# EAGLE design Tracksoar v1.2 (EAGLE 7.3.0)
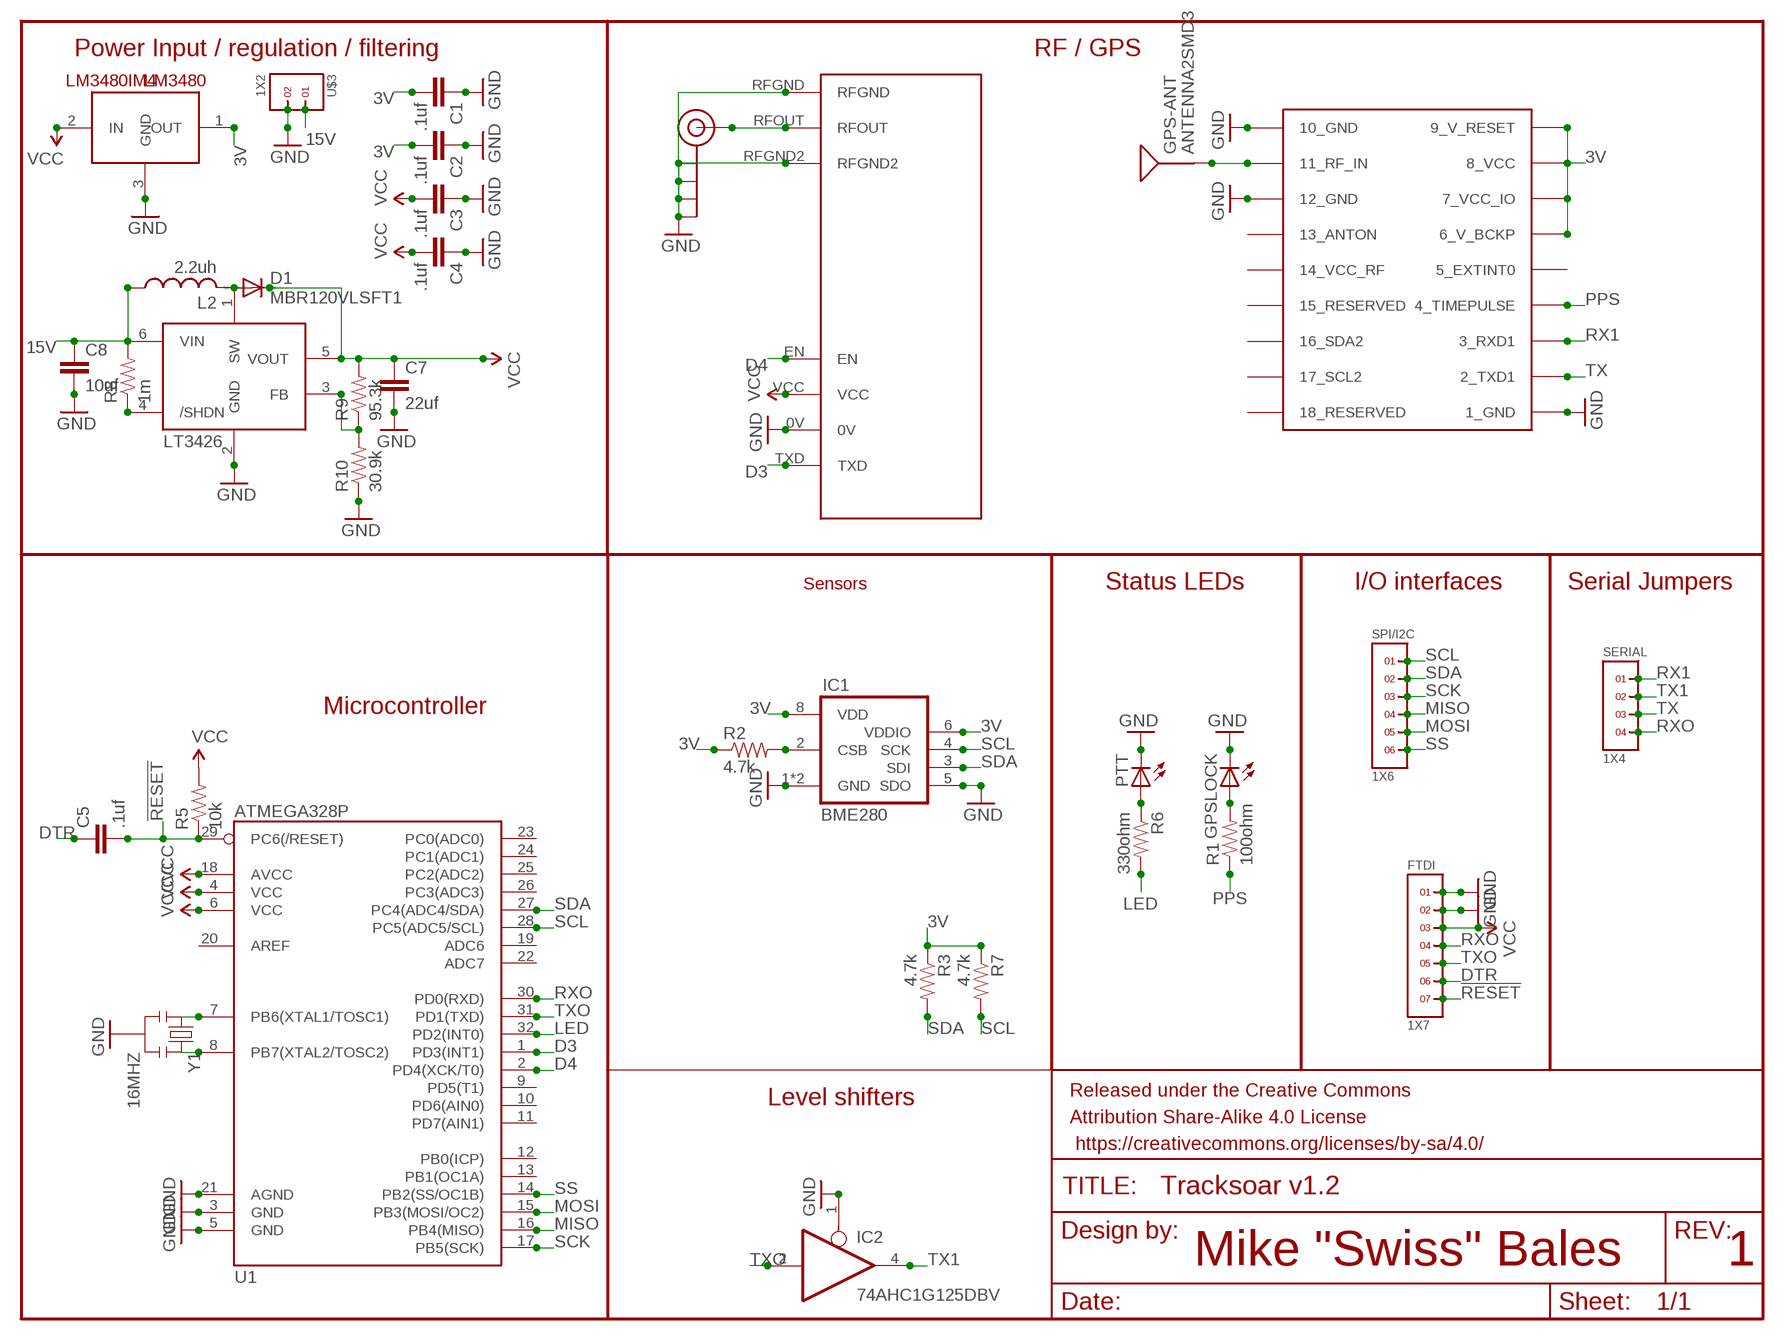
[diagram p0: schematic, sheet 1]

## Parts
C1  .1uf  CAP0805  [0805]
C2  .1uf  CAP0805  [0805]
C3  .1uf  CAP0805  [0805]
C4  .1uf  CAP0805  [0805]
C5  .1uf  CAP0805  [0805]
C7  22uf  CAP0805  [0805]
C8  10uf  CAP0805  [0805]
D1  MBR120VLSFT1  DIODE-SOD123  [SOD123]
FRAME1  FRAME-LETTER  [CREATIVE_COMMONS]
FTDI  1X7  [1X7]
GPS-ANT  ANTENNA2SMD3  [ANTENNA-CHIP4]
GPSLOCK  LEDCHIP-LED0805  [CHIP-LED0805]
IC1  BME280  [BME280]
IC2  74AHC1G125DBV  [SOT23-5]
J$1  SMA_EDGE  [SMA-EDGE]
L2  2.2uh  L-USL1812  [L1812]
LM3480  LM3480IM4  [SOT23-3]
LT3426  LT3426  [SOT23-6]
PTT  LEDCHIP-LED0805  [CHIP-LED0805]
R1  100ohm  RESISTOR0805-RES  [0805]
R2  4.7k  RESISTOR0805-RES  [0805]
R3  4.7k  RESISTOR0805-RES  [0805]
R5  10k  RESISTOR0805-RES  [0805]
R6  330ohm  RESISTOR0805-RES  [0805]
R7  4.7k  RESISTOR0805-RES  [0805]
R8  1m  RESISTOR0805-RES  [0805]
R9  95.3k  RESISTOR0805-RES  [0805]
R10  30.9k  RESISTOR0805-RES  [0805]
SERIAL  1X4  [1X4]
SPI/I2C  1X6  [1X6]
U1  ATMEGA328P  ATMEGA168MLF  [MLF32]
U$1  UBLOX_MAX  [UBLOX_MAX]
U$2  RADIOMETRIX-HX1  [RADIOMETRIX-HX1]
U$3  1X2  [1X2]
Y1  16MHZ  RESONATOR16MHZ  [RESONATOR-SMD]

## Nets
3V: C1.2 C2.2 IC1.6(VDDIO) IC1.8(VDD) LM3480.1(OUT) R2.1 R3.1 R7.1 U$1.6_V_BCKP U$1.7_VCC_IO U$1.8_VCC U$1.9_V_RESET
15V: C8.1 L2.1 LT3426.6(VIN) R8.2 U$3.1
!RESET: C5.2 FTDI.7 R5.1 U1.29(PC6(/RESET))
D3: U1.1(PD3(INT1)) U$2.TXD
D4: U1.2(PD4(XCK/T0)) U$2.EN
DTR: C5.1 FTDI.6
GND: C1.1 C2.1 C3.1 C4.1 C7.2 C8.2 FTDI.1 FTDI.2 GPSLOCK.C IC1.1(GND) IC1.5(SDO) IC1.7(GND) IC2.1(OE) J$1.GND@0(GND) J$1.GND@1(GND) J$1.GND@2(GND) J$1.GND@3(GND) LM3480.3(GND) LT3426.2(GND) PTT.C R10.1 U1.3(GND) U1.5(GND) U1.21(AGND) U$1.1_GND U$1.10_GND U$1.12_GND U$2.0V U$2.RFGND U$2.RFGND2 U$3.2 Y1.2
LED: R6.2 U1.32(PD2(INT0))
MISO: SPI/I2C.4 U1.16(PB4(MISO))
MOSI: SPI/I2C.5 U1.15(PB3(MOSI/OC2))
N$1: J$1.SIG(SIGNAL) U$2.RFOUT
N$2: IC1.2(CSB) R2.2
N$3: GPSLOCK.A R1.2
N$6: GPS-ANT.SIG(SIGNAL) U$1.11_RF_IN
N$9: D1.A L2.2 LT3426.1(SW)
N$12: LT3426.4(/SHDN) R8.1
N$13: LT3426.3(FB) R9.1 R10.2
N$14: U1.8(PB7(XTAL2/TOSC2)) Y1.3
N$26: U1.7(PB6(XTAL1/TOSC1)) Y1.1
N$27: PTT.A R6.1
PPS: R1.1 U$1.4_TIMEPULSE
RX1: SERIAL.1 U$1.3_RXD1
RXO: FTDI.4 SERIAL.4 U1.30(PD0(RXD))
SCK: SPI/I2C.3 U1.17(PB5(SCK))
SCL: IC1.4(SCK) R7.2 SPI/I2C.1 U1.28(PC5(ADC5/SCL))
SDA: IC1.3(SDI) R3.2 SPI/I2C.2 U1.27(PC4(ADC4/SDA))
SS: SPI/I2C.6 U1.14(PB2(SS/OC1B))
TX: SERIAL.3 U$1.2_TXD1
TX1: IC2.4(O) SERIAL.2
TXO: FTDI.5 IC2.2(I) U1.31(PD1(TXD))
VCC: C3.2 C4.2 C7.1 D1.C FTDI.3 LM3480.2(IN) LT3426.5(VOUT) R5.2 R9.2 U1.4(VCC) U1.6(VCC) U1.18(AVCC) U$2.VCC
Unconnected: U1.9(PD5(T1)) U1.10(PD6(AIN0)) U1.11(PD7(AIN1)) U1.12(PB0(ICP)) U1.13(PB1(OC1A)) U1.19(ADC6) U1.20(AREF) U1.22(ADC7) U1.23(PC0(ADC0)) U1.24(PC1(ADC1)) U1.25(PC2(ADC2)) U1.26(PC3(ADC3)) U$1.5_EXTINT0 U$1.13_ANTON U$1.14_VCC_RF U$1.15_RESERVED U$1.16_SDA2 U$1.17_SCL2 U$1.18_RESERVED

## Notes on the sheet
- Power Input / regulation / filtering | RF / GPS
- Sensors | Status LEDs | I/O interfaces | Serial Jumpers
- Microcontroller
- Level shifters
- Mike "Swiss" Bales | 1

## Power pins joined to a net without a drawn wire
GND: IC2.3(GND)
VCC: IC2.5(VCC)

## Library data of the parts
C1-C5 C7 C8 = SparkFun-Capacitors:CAP: Capacitor Standard 0603 ceramic capacitor, and 0.1" leaded capacitor.
D1 = diode:DIODE-: DIODE
FRAME1 = SparkFun-Aesthetics:FRAME-LETTER: Schematic Frame Standard 8.5x11 US Letter frame
FTDI = headers(2mm):1X7
GPS-ANT = SparkFun-RF:ANTENNA2: Chip antenna Single endded antenna. Common with smaller chip antennas. CHIP4 package is the GPS Chip Antenna SKU: GPS-08418. CHIP5 package is 2.4GHz chip antenna SKU: WRL-00144.
GPSLOCK PTT = adafruit:LED: LED OSRAM: - CHIPLED LG R971, LG N971, LY N971, LG Q971, LY Q971, LO R971, LY R971 LH N974, LH R974 LS Q976, LO Q976, LY Q976 LO Q996 - Hyper CHIPLED LW Q18S LB Q993, LB Q99A, LB R99A - SideLED LS A670, LO A670, LY A670, LG A670, LP A670 LB A673, LV A673, LT A673, LW A673 LH A674 LY A675 LS A676, LA A676, LO A676, LY A676, LW A676 LS A679, LY A679, LG A679 - Hyper Micro SIDELED® LS Y876, LA Y876, LO Y876, LY Y876 LT Y87S - SmartLED LW L88C, LW L88S LB L89C, LB L89S, LG L890 LS L89K, LO L89K, LY L89K LS L896, LA L896, LO L896, LY L896 - TOPLED LS T670, LO T670, LY T670, LG T670, LP T670 LSG T670, LSP T670, LSY T670, LOP T670, LYG T670 LG T671, LOG T671, LSG T671 LB T673, LV T673, LT T673, LW T673 LH T674 LS T676, LA T676, LO T676, LY T676, LB T676, LH T676, LSB T676, LW T676 LB T67C, LV T67C, LT T67C, LS T67K, LO T67K, LY T67K, LW E67C LS E67B, LA E67B, LO E67B, LY E67B, LB E67C, LV E67C, LT E67C LW T67C LS T679, LY T679, LG T679 LS T770, LO T770, LY T770, LG T770, LP T770 LB T773, LV T773, LT T773, LW T773 LH T774 LS E675, LA E675, LY E675, LS T675 LS T776, LA T776, LO T776, LY T776, LB T776 LHGB T686 LT T68C, LB T68C - Hyper Mini TOPLED® LB M676 - Mini TOPLED Santana® LG M470 LS M47K, LO M47K, LY M47K Source: http://www.osram.convergy.de/
IC1 = bosch-bme280:BME280: DIGITAL HUMIDITY, PRESSURE AND TEMPERATURE SENSOR * Digital interface I²C (up to 3.4 MHz) and SPI (3 and 4 wire, up to 10 MHz)* Supply voltage VDD main supply voltage range: 1.71 V to 3.6 V*VDDIO interface voltage range: 1.2 V to 3.6 V Operating range -40…+85 °C, 0…100 % rel. humidity, 300…1100 hPa The library has been designed by Richard Magdycz <https://www.facebook.com/groups/eaglecadsoftUK>
IC2 = 74xx-little-us:74*1G125: Single Bus Buffer Gate with 3-State Output
J$1 = SparkFun-Connectors:SMA_EDGE: SMA Antenna Connector End launch SMA connector. The paste layer has been removed so that the connector can be hand soldered onto the board after reflow.
L2 = resistor:L-US: INDUCTOR, American symbol
LM3480 = SparkFun-PowerIC:LM3480IM4: Small package linear regulator
LT3426 = adafruit:LT3426: LT3426 1.2MHz, 2A boost converter in SOT-23 http://www.linear.com/pc/productDetail.jsp?navId=H0,C1,C1003,C1042,C1031,C1061,P8430 (Linear website)
R1-R3 R5-R10 = SparkFun-Resistors:RESISTOR: Resistor Basic schematic elements and footprints for 0603, 1206, and PTH resistors.
SERIAL = headers(2mm):1X4
SPI/I2C = headers(2mm):1X6
U1 = SparkFun-DigitalIC:ATMEGA168: Atmel 32-pin 8-bit micro, 16k flash.
U$1 = Ava:UBLOX_MAX: UBLOX MAX
U$2 = Ava:RADIOMETRIX-HX1
U$3 = headers(2mm):1X2
Y1 = SparkFun-FreqCtrl:RESONATOR: Resonator Small SMD resonator. Used, eg, on the Arduino Pro/ Pro Mini boards. 8MHz- XTAL-08895 16MHz- XTAL-08900; PROD_ID: XTAL-08900

## Board
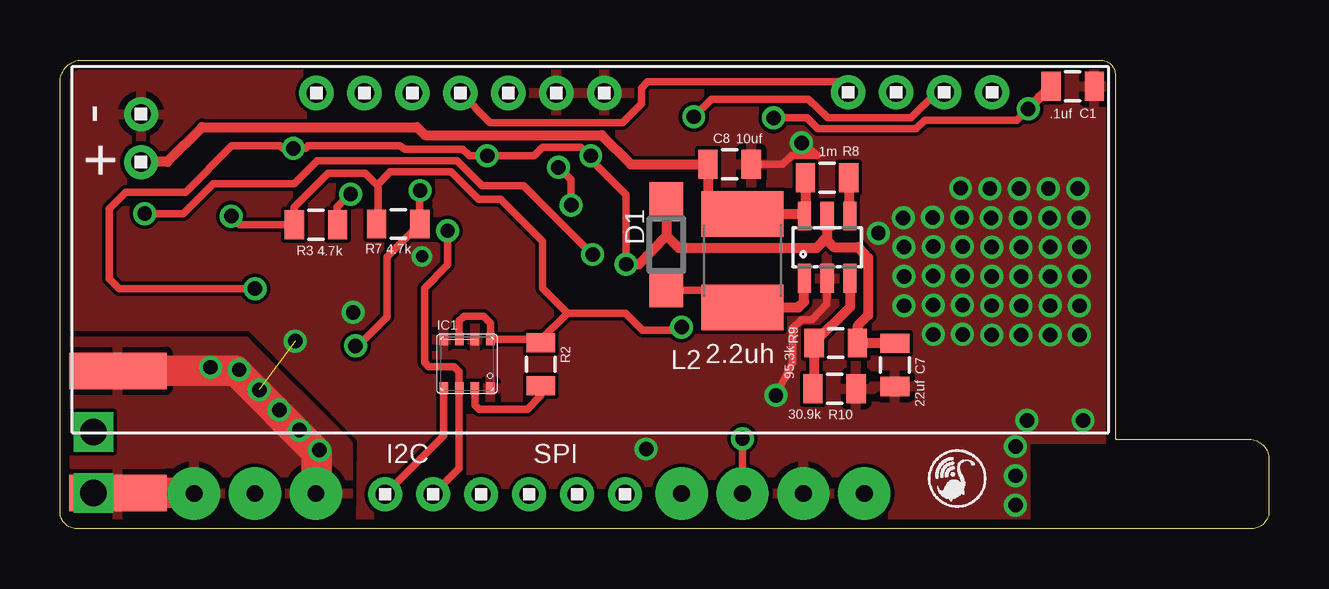
[diagram p1: board, top side]
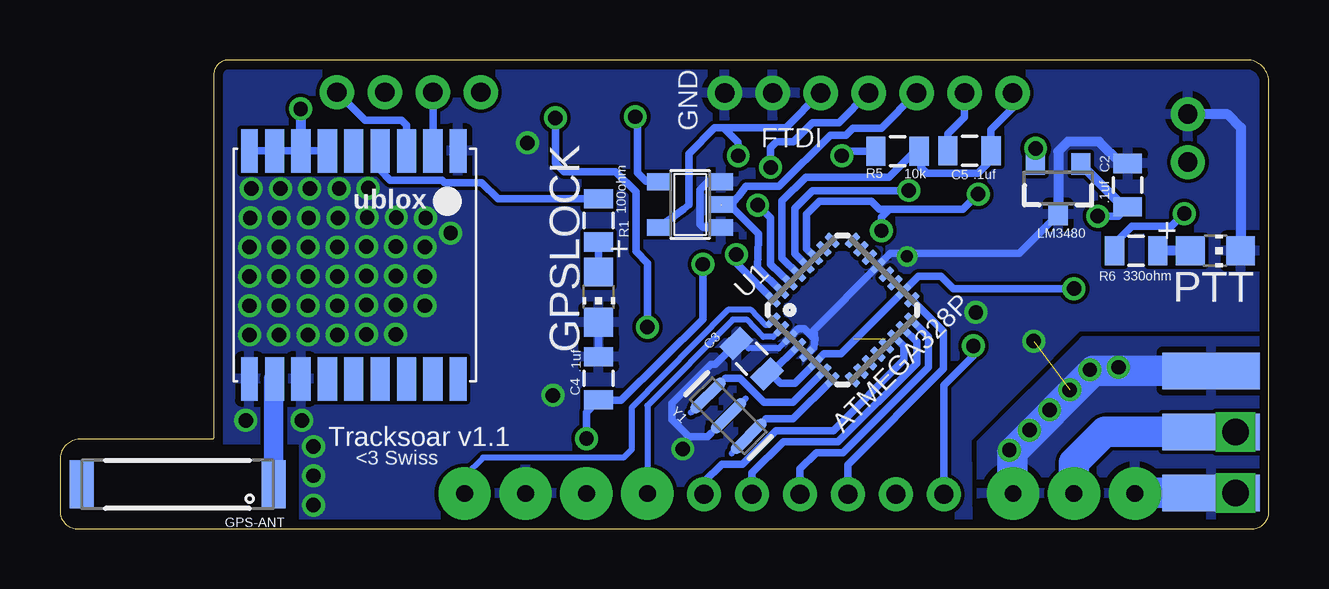
[diagram p2: board, bottom side, seen from below]

Size 50.39 x 19.53 mm. Coordinates in mm from the lower left corner, seen from the top.
Outline: 0.69,0 arc-90 0,0.76 0,18.67 arc-90 0.99,19.53 43.38,19.53 arc-90 43.99,18.87 43.99,3.78 arc90 44.04,3.73 49.58,3.73 arc-90 50.39,2.87 50.39,0.79 arc-90 49.68,0 0.69,0
Copper layers (1*16): Top 0.0356mm / dielectric 1.5011mm / Bottom 0.0356mm
Design rules "oshpark-2layer": minimum track width 6mil, minimum drill 13mil, track to track 6mil, track to pad 6mil, pad to pad 6mil, via to via 6mil, smd to smd 6mil, copper to edge 15mil, drill to drill 6mil, minimum pad ring 7mil, minimum via ring 7mil, stop-mask expansion 4mil, vias tented up to drill 0mil, thermal gap 10mil

### Footprints (pad centres in the part's own frame; a part is rotated, then mirrored left to right if it is on the bottom)
0805 = smd 0.8 x 1.2: 1 -0.9,0; 2 0.9,0
SOD123 = smd 1.4 x 1.4: A 1.9,0; C -1.9,0
1X7 = drill 0.8 pad 1.422: 1 -6,0; 2 -4,0; 3 -2,0; 4 0,0; 5 2,0; 6 4,0; 7 6,0
ANTENNA-CHIP4 = smd 1 x 2: NC 4,0; SIG -4,0
CHIP-LED0805 = smd 1.2 x 1.2: A 0,-1.05; C 0,1.05
BME280 = smd 0.35 x 0.5: 1 0.975,-1.025; 2 0.325,-1.025; 3 -0.325,-1.025; 4 -0.975,-1.025; 5 -0.975,1.025; 6 -0.325,1.025; 7 0.325,1.025; 8 0.975,1.025
SOT23-5 = smd 0.69 x 0.99: 1 -0.95,-1.29; 2 0,-1.29; 3 0.95,-1.29; 4 0.95,1.3; 5 -0.95,1.3
SMA-EDGE = smd 1.524 x 4.064: GND@0 0,0; GND@1 5.08,0; SIG 2.54,0 | smd 1.524 x 4.064 bottom: GND@2 0,0; GND@3 5.08,0
L1812 = smd 1.9 x 3.4: 1 -1.95,0; 2 1.95,0
SOT23-3 = smd 0.8 x 0.9: 1 -0.95,-1; 2 0.95,-1; 3 0,1.1
SOT23-6 = smd 0.55 x 1.2: 1 -0.95,-1.3; 2 0,-1.3; 3 0.95,-1.3; 4 0.95,1.3; 5 0,1.3; 6 -0.95,1.3
1X4 = drill 0.8 pad 1.422: 1 -3,0; 2 -1,0; 3 1,0; 4 3,0
1X6 = drill 0.8 pad 1.422: 1 -5,0; 2 -3,0; 3 -1,0; 4 1,0; 5 3,0; 6 5,0
MLF32 = smd 0.7 x 0.3: 1 -2.35,1.75; 2 -2.35,1.25; 3 -2.35,0.75; 4 -2.35,0.25; 5 -2.35,-0.25; 6 -2.35,-0.75; 7 -2.35,-1.25; 8 -2.35,-1.75; 17 2.35,-1.75; 18 2.35,-1.25; 19 2.35,-0.75; 20 2.35,-0.25; 21 2.35,0.25; 22 2.35,0.75; 23 2.35,1.25; 24 2.35,1.75 | smd 0.3 x 0.7: 9 -1.75,-2.35; 10 -1.25,-2.35; 11 -0.75,-2.35; 12 -0.25,-2.35; 13 0.25,-2.35; 14 0.75,-2.35; 15 1.25,-2.35; 16 1.75,-2.35; 25 1.75,2.35; 26 1.25,2.35; 27 0.75,2.35; 28 0.25,2.35; 29 -0.25,2.35; 30 -0.75,2.35; 31 -1.25,2.35; 32 -1.75,2.35
UBLOX_MAX = smd 1.8 x 0.7: 1_GND 4.95,-4.4; 9_V_RESET 4.95,4.3; 10_GND -4.55,4.3; 18_RESERVED -4.55,-4.4 | smd 1.8 x 0.8: 2_TXD1 4.95,-3.35; 3_RXD1 4.95,-2.25; 4_TIMEPULSE 4.95,-1.15; 5_EXTINT0 4.95,-0.05; 6_V_BCKP 4.95,1.05; 7_VCC_IO 4.95,2.15; 8_VCC 4.95,3.25; 11_RF_IN -4.55,3.25; 12_GND -4.55,2.15; 13_ANTON -4.55,1.05; 14_VCC_RF -4.55,-0.05; 15_RESERVED -4.55,-1.15; 16_SDA2 -4.55,-2.25; 17_SCL2 -4.55,-3.35
RADIOMETRIX-HX1 = drill 0.7 pad 2.184: 0V 8.89,-10.16; EN 3.81,-10.16; RFGND -11.43,-10.16; RFGND2 -16.51,-10.16; RFOUT -13.97,-10.16; TXD 11.43,-10.16; VCC 6.35,-10.16
1X2 = drill 0.8 pad 1.422: 1 -1,0; 2 1,0
RESONATOR-SMD = smd 0.45 x 1.905: 1 -1.2,0; 2 0,0; 3 1.2,0

### Placement (x,y rotation side)
C1  42.22,18.44 180 top
C2  5.89,14.33 270 bottom
C3  21.57,7.09 315 bottom
C4  27.94,6.27 270 bottom
C5  12.48,15.76 0 bottom
C7  34.8,6.83 270 top
C8  27.92,15.19 0 top
D1  25.27,11.84 270 top
FRAME1  14.35,-8.18 0 top  (outside the outline)
FTDI  16.69,18.16 180 top
GPS-ANT  45.49,1.85 180 bottom
GPSLOCK  27.94,9.65 180 bottom
IC1  16.97,6.88 0 top
IC2  24.13,13.51 90 bottom
J$1  2.41,1.5 90 bottom
L2  28.45,11.18 270 top
LM3480  8.79,14.2 180 bottom
LT3426  31.98,11.73 0 top
PTT  2.24,11.58 270 bottom
R1  27.94,12.85 270 bottom
R2  20.04,6.86 270 top
R3  10.67,12.67 0 top
R5  15.48,15.74 180 bottom
R6  5.54,11.58 180 bottom
R7  14.1,12.7 0 top
R8  31.98,14.63 180 top
R9  32.33,7.75 0 top
R10  32.28,5.84 180 top
SERIAL  35.86,18.19 180 top
SPI/I2C  18.56,1.43 0 top
U1  17.78,9.12 45 bottom
U$1  38.2,10.79 90 bottom
U$2  22.1,11.63 0 top
U$3  3.38,16.28 90 top
Y1  22.53,4.71 315 bottom

### Tracks (layer width: path | path; a pad name or v marks a point on that pad's centre or on a via)
3V  (via drill 0.6)
  Top 0.305: R3.1 7.49,12.67 v7.14,13.03 | R3.1 9.77,13.4 11.18,14.81 12.73,14.81 13.21,14.33 | 13.21,14.33 13.26,14.21 13.26,12.76 R7.1 | 13.21,14.33 13.77,14.88 16.31,14.88 17.45,13.74 18.37,13.74 20.12,11.99 20.12,10.03 21.16,8.99 | 9.78,12.66 R3.1 | 21.16,8.99 23.57,8.99 24.28,8.28 25.78,8.28 v25.91,8.41 | 40.89,17.99 C1.2 | v40.36,17.5 39.88,17.02 36.04,17.02 35.69,16.66 31.6,16.66 31.14,17.12 v29.74,17.12 | IC1.6 16.64,8.66 16.84,8.86 17.65,8.86 17.94,8.58 IC1.8 19.89,7.91 R2.1 20.04,7.87 21.16,8.99
  Top 0.406: C1.2 40.84,17.98 v40.36,17.5
  Bottom 0.305: U$1.9_V_RESET U$1.8_VCC U$1.7_VCC_IO U$1.6_V_BCKP 39.27,15.73 | v7.14,13.03 6.29,13.03 C2.2 | v25.91,8.41 25.91,11.07 26.39,11.56 26.39,14.05 27.23,14.88 29.39,14.88 29.74,15.24 v29.74,17.12
  Bottom 0.406: C2.2 6.07,13.43 LM3480.1 | v40.36,17.5 U$1.7_VCC_IO
15V
  Top 0.406: R8.2 31.08,13.08 LT3426.6 30.94,13.13 L2.1 28.43,13.11 27.76,13.11 27.02,13.85 C8.1 23.8,15.19 22.58,16.41 15.22,16.41 14.89,16.74 5.92,16.74 4.47,15.29 3.39,15.29 U$3.1
!RESET
  Bottom 0.305: U1.29 20.3,11.28 20.3,13.67 19.3,14.66 15.85,14.66 14.77,15.74 R5.1 14.5,15.06 14.25,14.81 12.14,14.81 11.58,15.37 C5.2 11.58,16.64 10.69,17.53 FTDI.7
D3
  Bottom 0.254: U1.1 20.89,8.48 20.98,8.48 21.59,9.12 22.56,9.12 26.57,5.05 26.57,3.3 26.9,2.97 32.77,2.97 33.53,2.21 U$2.TXD
D4
  Bottom 0.254: U1.2 20.67,8 21.08,8 21.77,8.71 22.35,8.71 25.91,5.13 U$2.EN
DTR
  Bottom 0.305: FTDI.6 12.69,17.16 13.39,16.46 13.39,15.77
  Bottom 0.406: 13.39,15.77 C5.1
GND  (via drill 0.5, 0.6, 1.1)  (2 unrouted)
  Top 0.305: LT3426.2 31.98,9.37 31.34,8.71 30.91,8.71 30.53,8.36 30.53,6.91 v29.85,5.56 | C8.2 30.13,15.19 30.51,15.57 31.57,15.57 v30.91,16.08
  Top 0.406: U$2.RFGND2 5.61,1.47 5.61,1.5
  Top 1.27: J$1.GND@1 7.32,6.58 10.69,3.2 10.69,1.5 U$2.RFGND | 2.31,1.5 5.61,1.5
  Bottom 0.254: U1.3 20.44,7.52 21.69,7.52 21.9,7.72 C3.1
  Bottom 0.305: U1.5 18.97,7.57 18.92,7.9 | 18.92,7.9 19.36,8.33 19.63,8.33 U1.3 | 18.92,7.9 18.97,8.28 U1.21 15.77,11.48 10.41,11.48 LM3480.3 | GPSLOCK.C C4.1 | 22.85,14.49 IC2.3 22.85,14.45 23.39,14.45 23.72,14.12 23.72,12.7 23.59,12.56 IC2.1 | C3.1 23.07,6.86 23.27,6.86 24.89,5.23 24.89,4.55 24.18,3.84 23.41,3.84 23.25,3.99
  Bottom 0.406: PTT.C 1.17,11.6 1.17,16.71 1.73,17.27 3.37,17.27 U$3.2 | 5.84,15.28 C2.1 6.18,15.23 7.09,16.13 8.38,16.13 8.79,15.72 LM3480.3
  Bottom 1.27: U$2.RFGND2 5.56,1.5 J$1.GND@2 | J$1.GND@1 7.32,6.58 10.69,3.2 10.69,1.5 U$2.RFGND
  other vias: 9.8,7.82 15.09,11.35 12.22,9.02 1.4,1.5 24.44,3.33 42.49,8.08 41.28,8.08 40.06,8.08 38.84,8.08 37.62,8.1 36.4,8.1 42.49,9.3 41.28,9.3 40.06,9.3 38.84,9.3 37.62,9.32 36.4,9.32 35.18,9.3 42.49,10.52 41.28,10.52 40.06,10.52 38.84,10.52 37.62,10.54 36.4,10.54 35.18,10.52 42.49,11.73 41.28,11.73 40.06,11.73 38.84,11.73 37.62,11.76 36.4,11.76 35.18,11.73 42.47,12.95 41.25,12.95 40.03,12.95 38.81,12.95 41.2,14.17 42.65,4.52 39.83,3.43 39.83,2.21 39.83,0.99 40.31,4.52 39.98,14.17 42.42,14.17 37.59,12.98 36.37,12.98 35.15,12.95 34.11,12.32 38.76,14.17 37.54,14.2 6.27,6.73 7.47,6.63 8.31,5.79 9.14,4.95 9.98,4.11 10.82,3.28
  pour Top: 0,19.56 44.02,19.56 44.02,3.73 40.23,3.73 40.23,0 12.55,0 12.6,3.76 7.95,8.43 0,8.43
  pour Bottom: 0,19.56 44.02,19.56 44.02,3.73 40.23,3.73 40.23,0 12.55,0 12.6,3.76 7.95,8.43 0,8.43
  pour Bottom: 0,7.82 7.72,7.82 11.99,3.56 11.99,0 0,0
  pour Top: 0,7.82 7.72,7.82 11.99,3.56 11.99,0 0,0
LED  (via drill 0.6)
  Top 0.305: v3.53,13.13 5.13,13.13 6.38,14.38 9.75,14.38 10.72,15.34 16.56,15.34 17.6,14.3 19.33,14.3 v22.2,11.43
  Bottom 0.305: R6.2 6.44,11.88 5.72,12.6 4.06,12.6 v3.53,13.13 | v22.2,11.43 22.2,11.06 U1.32
MISO
  Bottom 0.305: U1.16 14.2,8.01 14.2,6.73 17.76,3.17 18.87,3.17 19.55,2.5 SPI/I2C.4
MOSI
  Bottom 0.305: U1.15 14.68,7.79 14.68,6.91 17.96,3.63 20.24,3.63 21.55,2.33 SPI/I2C.5
N$1
  Bottom 1.27: J$1.SIG 6.83,4.04 8.13,2.74 U$2.RFOUT
N$2
  Top 0.305: R2.2 20.04,5.54 19.48,4.98 17.48,4.98 17.3,5.16 IC1.2
N$3
  Bottom 0.305: R1.2 GPSLOCK.A
N$6
  Bottom 0.813: U$1.11_RF_IN 41.49,6.24 GPS-ANT.SIG
N$9
  Top 0.305: D1.A 27.74,9.94 L2.2
  Top 0.406: L2.2 30.79,9.23 31.01,9.45 31.01,10.42 LT3426.1
N$12
  Top 0.406: R8.1 32.88,13.08 LT3426.4
N$13
  Top 0.406: LT3426.3 32.93,9.24 R9.1 31.44,5.89 R10.2
N$14
  Bottom 0.305: U1.8 19.85,4.58 20.97,4.58
N$18  (via drill 1.1)
  other vias: 1.4,4.04
N$26
  Bottom 0.305: U1.7 19.85,5.28 21.06,5.28 22.05,6.28 22.66,6.28
N$27
  Bottom 0.406: PTT.A R6.1
PPS
  Bottom 0.305: R1.1 32.14,13.75 32.82,14.43 34.37,14.43 34.47,14.53 36.63,14.53 37.06,14.96 U$1.4_TIMEPULSE
RX1
  Bottom 0.305: U$1.3_RXD1 35.95,16.83 36.15,17.02 37.67,17.02 SERIAL.1
RXO  (via drill 0.6)
  Top 0.305: v21.31,13.49 21.31,14.55 v20.78,15.06 | FTDI.4 17.93,16.92 23.45,16.92 24.23,17.7 24.23,18.36 24.49,18.62 32.43,18.62 SERIAL.4 32.86,18.21
  Bottom 0.305: U1.30 20.78,11.03 20.78,12.95 v21.31,13.49 | v20.78,15.06 20.78,15.87 20.52,16.13 19.81,16.13 19.03,16.92 17.93,16.92 FTDI.4
SCK
  Bottom 0.305: U1.17 13.56,8.23 13.56,6.68 17.55,2.67 SPI/I2C.3
SCL  (via drill 0.6)
  Top 0.305: R7.2 15,13.6 v15.01,14.1 | 15.24,12.7 R7.2 | R7.2 15.07,12.48 | IC1.4 15.99,3.87 SPI/I2C.1 | v12.32,7.62 12.42,7.62 13.64,8.84 13.64,11.34 R7.2
  Bottom 0.305: U1.28 19.76,11.45 19.76,13.36 19.03,14.1 v15.01,14.1 | v12.32,7.62 12.32,7.21 13.56,5.98 SPI/I2C.1 | SPI/I2C.1
SDA  (via drill 0.6)
  Top 0.305: v12.12,13.94 12.09,13.94 11.56,13.41 11.56,12.69 R3.2 | SPI/I2C.2 16.64,2.52 IC1.3 16.64,6.55 16.43,6.76 15.37,6.76 15.19,6.93 15.19,10.03 16.16,11 v16.16,12.42
  Bottom 0.305: U1.27 19.28,11.68 19.28,13.11 18.75,13.64 16.56,13.64 16.23,13.31 15.83,13.31 | 15.83,13.31 12.75,13.31 v12.12,13.94 | v16.16,12.42 16.16,12.98 15.83,13.31
SS
  Bottom 0.305: U1.14 15.22,7.61 15.22,7.04 18.16,4.09 20.55,4.09 21.95,2.69 22.81,2.69 23.55,1.95 SPI/I2C.6
TX
  Bottom 0.305: U$1.2_TXD1 SERIAL.3
TX1  (via drill 0.6)
  Top 0.305: SERIAL.2 36.56,18.19 35.46,17.12 32,17.12 31.19,17.91 27.15,17.91 v26.42,17.17
  Bottom 0.305: IC2.4 25.89,14.49 25.97,14.49 26.32,14.83 26.32,17.07 v26.42,17.17
TXO
  Bottom 0.305: U1.31 21.31,10.88 21.29,12.09 21.29,12.29 22.35,13.36 | 22.35,13.36 22.66,13.36 IC2.2 | 22.35,13.36 22.35,13.61 22.1,13.87 21.79,14.27 20.42,14.27 18.29,16.41 17.63,16.41 17.35,16.69 16.16,16.69 FTDI.5
VCC  (via drill 0.6)
  Top 0.305: v8.13,10.01 2.46,10.01 2.06,10.41 2.06,13.33 2.74,14.02 5.23,14.02 7.16,15.95 9.17,15.95 9.27,15.85 v9.73,15.85 10.24,15.85 10.34,15.95 14.15,15.95 14.38,15.82 16.79,15.82 17.07,15.54 v17.81,15.54 19.76,15.54 20.12,15.9 21.69,15.9 v22.12,15.54 21.97,15.54 23.6,13.92 v23.6,11.02 | U$2.VCC v28.45,3.76
  Top 0.406: D1.C 25.27,12.22 | 25.27,12.22 25.78,11.71 31.55,11.71 31.98,12.14 LT3426.5 31.98,12.01 32.26,11.73 33.27,11.73 33.68,11.3 33.68,8.89 33.25,8.46 33.25,7.76 R9.2 33.25,7.73 C7.1 | v23.6,11.02 24.13,11.02 25.27,12.22
  Bottom 0.305: U1.4 20.75,6.5 C3.2 20.78,6.48 20.37,6.07 19.77,6.07 U1.6 18.54,7.29 17.84,7.29 U1.18 14.62,10.52 13.67,10.52 13.16,10.01 v8.13,10.01 | IC2.5 24.4,13.32 24.18,13.51 24.18,15.62 23.11,16.71 22.73,16.71 | 22.73,16.71 20.14,16.71 FTDI.3 | v9.73,15.85 9.73,15.21 LM3480.2 | R5.2 17.46,15.74 v17.81,15.54 | v22.12,15.54 22.12,16.1 22.73,16.71 | v28.45,3.76 28.45,4.87 C4.2 | C4.2 27.67,5.37 | v23.6,11.02 23.6,8.74 27,5.36 27.93,5.36 C4.2

### Text on the board
tNames: - | + | I2C | SPI
bNames: GND | FTDI | Tracksoar v1.1 | <3 Swiss